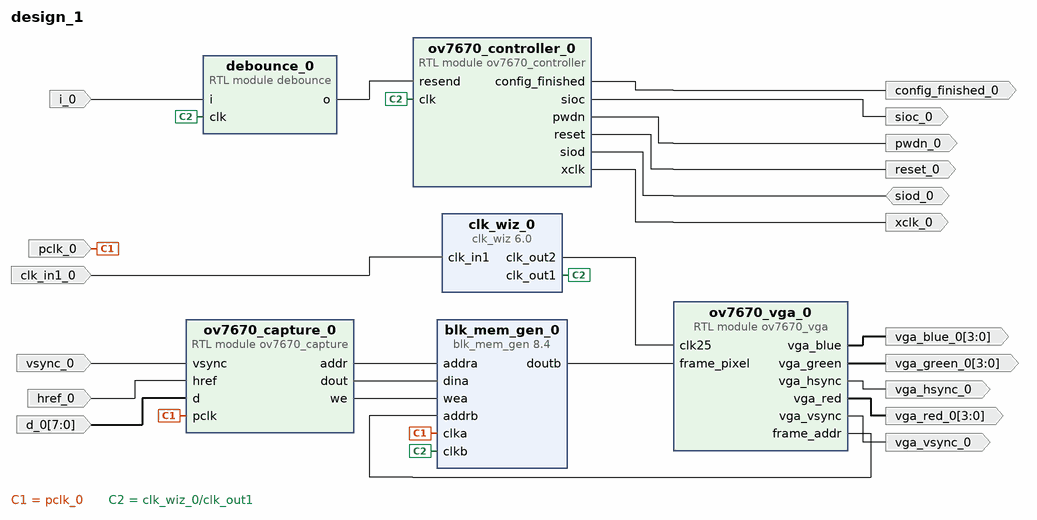
[diagram p0: block diagram of the top level]
# Vivado block design design_1, xc7a100tcsg324-1, Vivado 2018.3
create_bd_design design_1

create_bd_port -dir I pclk_0
create_bd_port -dir I vsync_0
create_bd_port -dir I href_0
create_bd_port -dir I -from 7 -to 0 d_0
create_bd_port -dir O -from 3 -to 0 vga_red_0
create_bd_port -dir O -from 3 -to 0 vga_green_0
create_bd_port -dir O -from 3 -to 0 vga_blue_0
create_bd_port -dir O vga_hsync_0
create_bd_port -dir O vga_vsync_0
create_bd_port -dir O config_finished_0
create_bd_port -dir O sioc_0
create_bd_port -dir IO siod_0
create_bd_port -dir O -type rst reset_0
create_bd_port -dir O pwdn_0
create_bd_port -dir O xclk_0
create_bd_port -dir I i_0
create_bd_port -dir I -type clk clk_in1_0

create_bd_cell -type module -reference ov7670_controller ov7670_controller_0
create_bd_cell -type module -reference ov7670_capture ov7670_capture_0
create_bd_cell -type module -reference debounce debounce_0
create_bd_cell -type ip -vlnv xilinx.com:ip:clk_wiz:6.0 clk_wiz_0
set_property -dict [list \
  CONFIG.CLKOUT1_JITTER 151.636 \
  CONFIG.CLKOUT1_REQUESTED_OUT_FREQ 50 \
  CONFIG.CLKOUT2_JITTER 175.402 \
  CONFIG.CLKOUT2_PHASE_ERROR 98.575 \
  CONFIG.CLKOUT2_REQUESTED_OUT_FREQ 25 \
  CONFIG.CLKOUT2_USED true \
  CONFIG.CLK_IN1_BOARD_INTERFACE sys_clock \
  CONFIG.MMCM_CLKOUT0_DIVIDE_F 20.000 \
  CONFIG.MMCM_CLKOUT1_DIVIDE 40 \
  CONFIG.MMCM_DIVCLK_DIVIDE 1 \
  CONFIG.NUM_OUT_CLKS 2 \
  CONFIG.USE_BOARD_FLOW true \
  CONFIG.USE_LOCKED false \
  CONFIG.USE_RESET false \
] [get_bd_cells clk_wiz_0]
create_bd_cell -type ip -vlnv xilinx.com:ip:blk_mem_gen:8.4 blk_mem_gen_0
set_property -dict [list \
  CONFIG.Enable_32bit_Address false \
  CONFIG.Enable_A Always_Enabled \
  CONFIG.Enable_B Always_Enabled \
  CONFIG.Memory_Type Simple_Dual_Port_RAM \
  CONFIG.Operating_Mode_A NO_CHANGE \
  CONFIG.Port_A_Write_Rate 50 \
  CONFIG.Port_B_Clock 100 \
  CONFIG.Port_B_Enable_Rate 100 \
  CONFIG.Read_Width_B 12 \
  CONFIG.Register_PortB_Output_of_Memory_Primitives true \
  CONFIG.Use_Byte_Write_Enable false \
  CONFIG.Use_RSTB_Pin false \
  CONFIG.Write_Depth_A 262144 \
  CONFIG.Write_Width_A 12 \
  CONFIG.Write_Width_B 12 \
  CONFIG.use_bram_block Stand_Alone \
] [get_bd_cells blk_mem_gen_0]
create_bd_cell -type module -reference ov7670_vga ov7670_vga_0

# ---- connections ----

connect_bd_net -net pclk_0_1 [get_bd_ports pclk_0] [get_bd_pins ov7670_capture_0/pclk] [get_bd_pins blk_mem_gen_0/clka]
connect_bd_net -net vsync_0_1 [get_bd_ports vsync_0] [get_bd_pins ov7670_capture_0/vsync]
connect_bd_net -net href_0_1 [get_bd_ports href_0] [get_bd_pins ov7670_capture_0/href]
connect_bd_net -net d_0_1 [get_bd_ports d_0] [get_bd_pins ov7670_capture_0/d]
connect_bd_net [get_bd_pins ov7670_capture_0/addr] [get_bd_pins blk_mem_gen_0/addra]
connect_bd_net [get_bd_pins ov7670_capture_0/dout] [get_bd_pins blk_mem_gen_0/dina]
connect_bd_net [get_bd_pins ov7670_capture_0/we] [get_bd_pins blk_mem_gen_0/wea]
connect_bd_net [get_bd_pins clk_wiz_0/clk_out1] [get_bd_pins blk_mem_gen_0/clkb] [get_bd_pins ov7670_controller_0/clk] [get_bd_pins debounce_0/clk]
connect_bd_net [get_bd_pins ov7670_vga_0/frame_addr] [get_bd_pins blk_mem_gen_0/addrb]
connect_bd_net [get_bd_pins blk_mem_gen_0/doutb] [get_bd_pins ov7670_vga_0/frame_pixel]
connect_bd_net [get_bd_pins debounce_0/o] [get_bd_pins ov7670_controller_0/resend]
connect_bd_net [get_bd_pins clk_wiz_0/clk_out2] [get_bd_pins ov7670_vga_0/clk25]
connect_bd_net [get_bd_pins ov7670_vga_0/vga_red] [get_bd_ports vga_red_0]
connect_bd_net [get_bd_pins ov7670_vga_0/vga_green] [get_bd_ports vga_green_0]
connect_bd_net [get_bd_pins ov7670_vga_0/vga_blue] [get_bd_ports vga_blue_0]
connect_bd_net [get_bd_pins ov7670_vga_0/vga_hsync] [get_bd_ports vga_hsync_0]
connect_bd_net [get_bd_pins ov7670_vga_0/vga_vsync] [get_bd_ports vga_vsync_0]
connect_bd_net [get_bd_pins ov7670_controller_0/config_finished] [get_bd_ports config_finished_0]
connect_bd_net [get_bd_pins ov7670_controller_0/sioc] [get_bd_ports sioc_0]
connect_bd_net [get_bd_ports siod_0] [get_bd_pins ov7670_controller_0/siod]
connect_bd_net [get_bd_pins ov7670_controller_0/reset] [get_bd_ports reset_0]
connect_bd_net [get_bd_pins ov7670_controller_0/pwdn] [get_bd_ports pwdn_0]
connect_bd_net [get_bd_pins ov7670_controller_0/xclk] [get_bd_ports xclk_0]
connect_bd_net -net i_0_1 [get_bd_ports i_0] [get_bd_pins debounce_0/i]
connect_bd_net -net clk_in1_0_1 [get_bd_ports clk_in1_0] [get_bd_pins clk_wiz_0/clk_in1]

validate_bd_design
save_bd_design
